# Altium schematic sheet Rx_logic.SchDoc: Balise IR-Rx - Logic
size A3; Author: B Labbe; CompanyName: Oufffteam; DrawnBy: B Labbe; Engineer: B Labbe; Organization: Oufffteam; Address1: L3, 12a Rodborough Rd; Address2: Frenchs Forest; Address3: NSW; Address4: Australia 2086; Revision: B; SheetNumber: 3; SheetTotal: 5; DocumentName: Balise IR-Rx - Logic
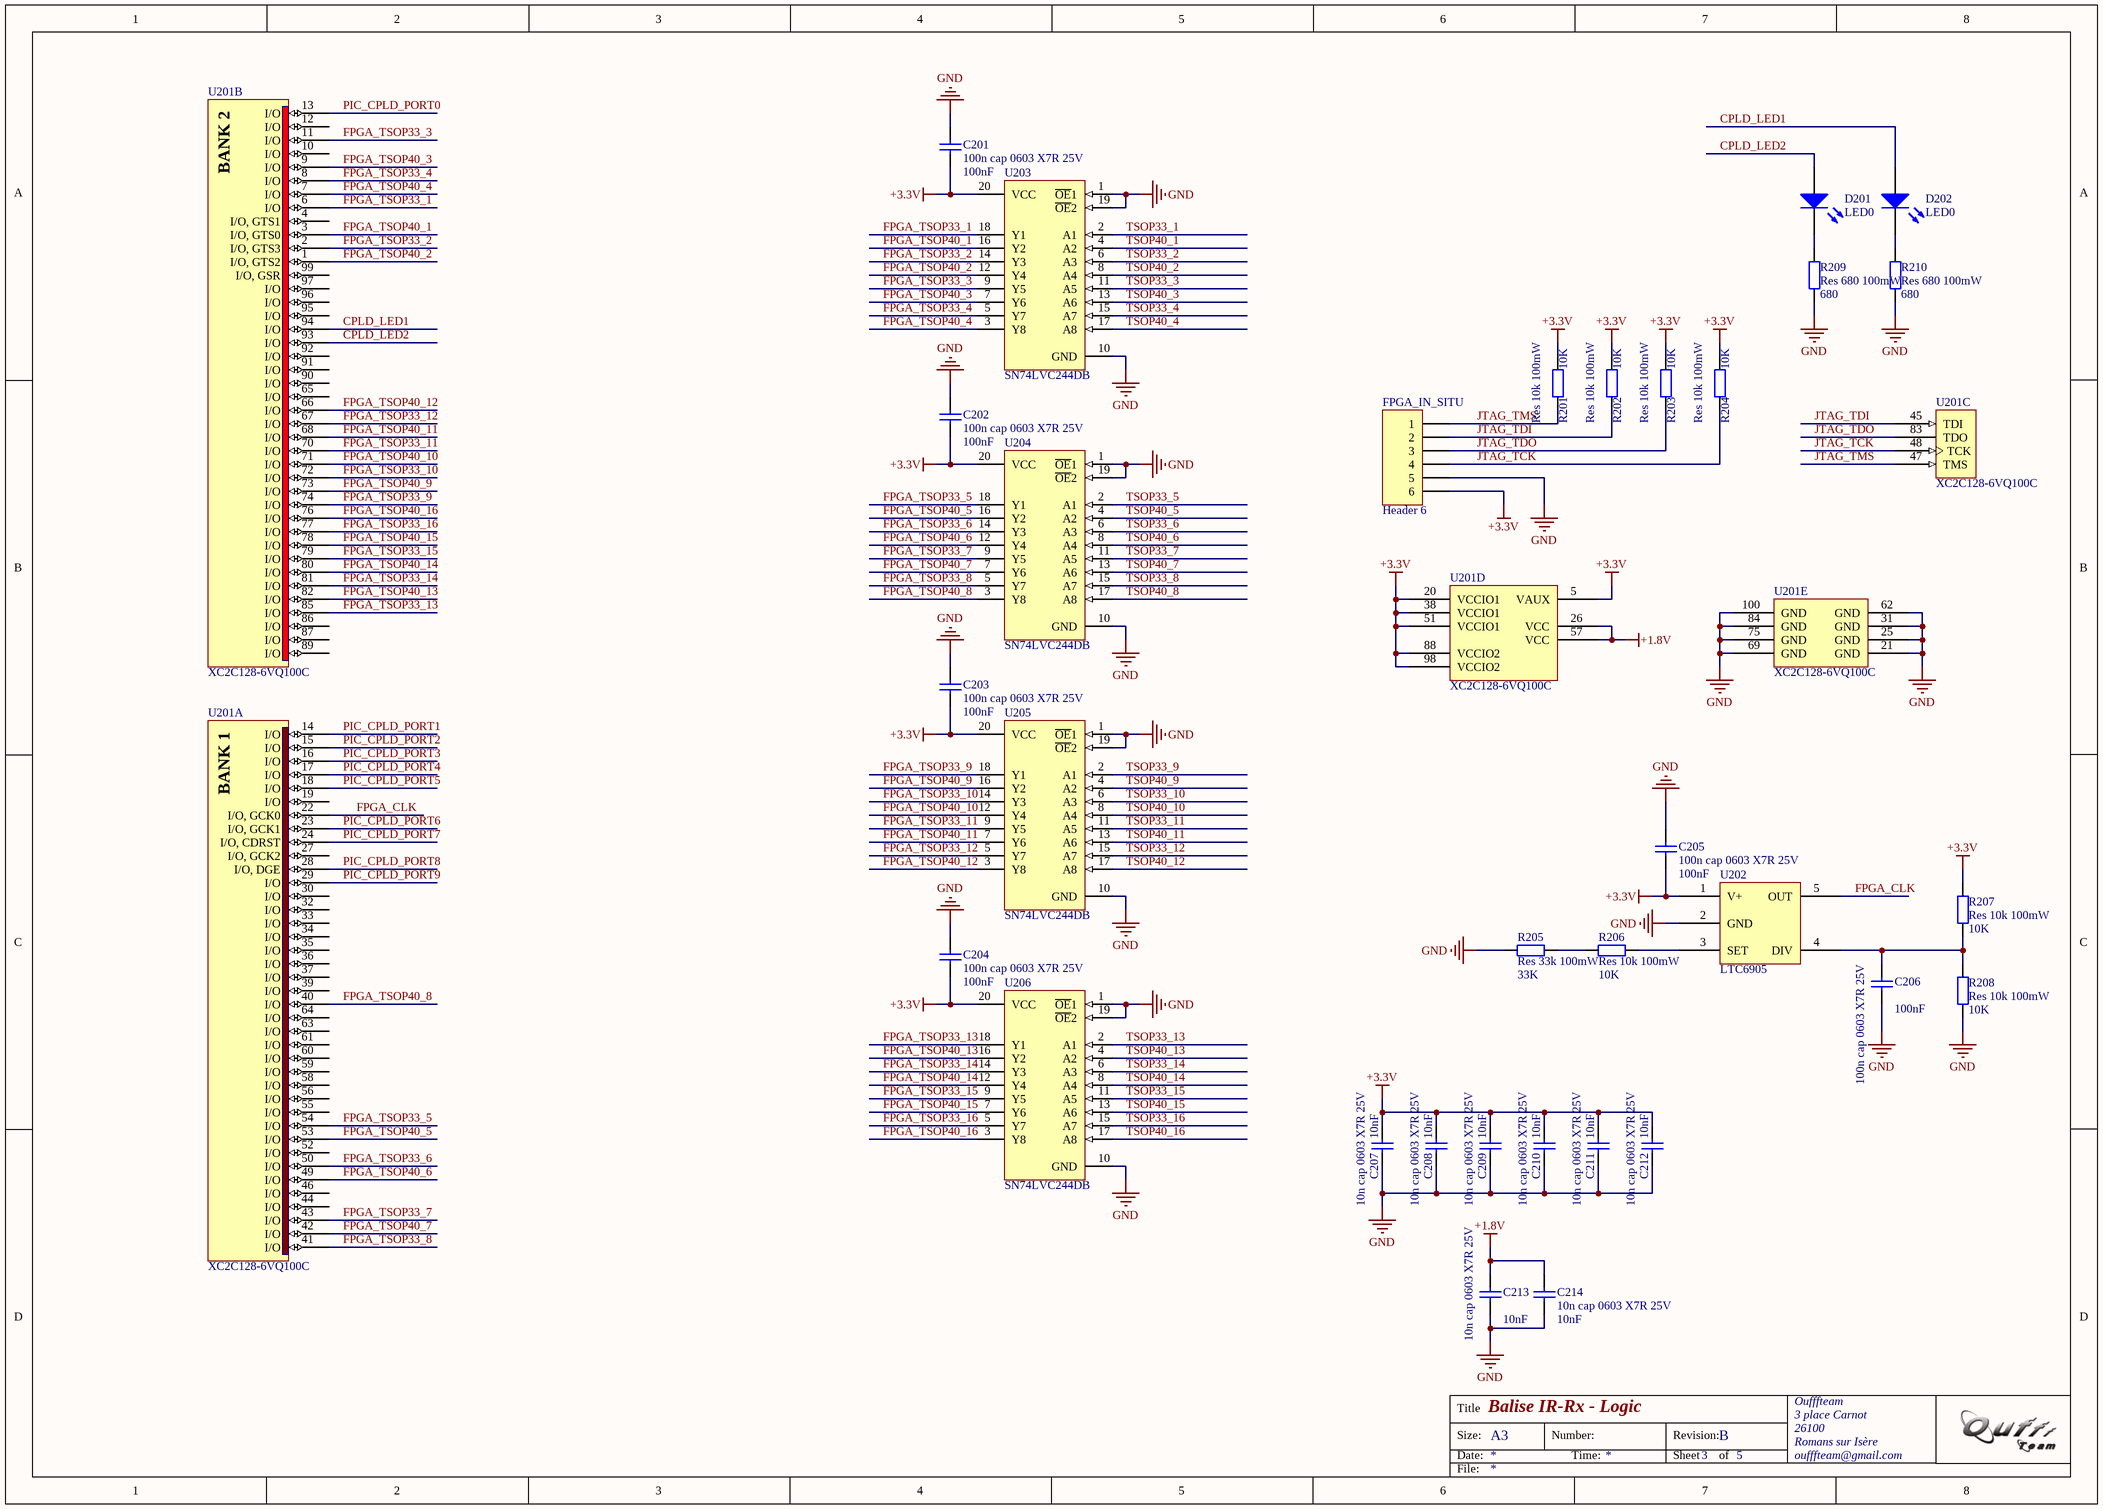
[diagram p0: Rx_logic.SchDoc]

## Parts
C201  100n cap 0603 X7R 25V  value 100nF  [0603]
C202  100n cap 0603 X7R 25V  value 100nF  [0603]
C203  100n cap 0603 X7R 25V  value 100nF  [0603]
C204  100n cap 0603 X7R 25V  value 100nF  [0603]
C205  100n cap 0603 X7R 25V  value 100nF  [0603]
C206  100n cap 0603 X7R 25V  value 100nF  [0603]
C207  10n cap 0603 X7R 25V  value 10nF  [0603]
C208  10n cap 0603 X7R 25V  value 10nF  [0603]
C209  10n cap 0603 X7R 25V  value 10nF  [0603]
C210  10n cap 0603 X7R 25V  value 10nF  [0603]
C211  10n cap 0603 X7R 25V  value 10nF  [0603]
C212  10n cap 0603 X7R 25V  value 10nF  [0603]
C213  10n cap 0603 X7R 25V  value 10nF  [0603]
C214  10n cap 0603 X7R 25V  value 10nF  [0603]
D201  LED0  [0603]
D202  LED0  [0603]
FPGA_IN_SITU  Header 6  [HDR1X6]
R201  Res 10k 100mW  value 10K  [0603]
R202  Res 10k 100mW  value 10K  [0603]
R203  Res 10k 100mW  value 10K  [0603]
R204  Res 10k 100mW  value 10K  [0603]
R205  Res 33k 100mW  value 33K  [0603]
R206  Res 10k 100mW  value 10K  [0603]
R207  Res 10k 100mW  value 10K  [0603]
R208  Res 10k 100mW  value 10K  [0603]
R209  Res 680 100mW  value 680  [0603]
R210  Res 680 100mW  value 680  [0603]
U201  XC2C128-6VQ100C  [VQ100_N]  (parts A,B,C,D,E of 5)
U202  LTC6905  [SOT23-5]
U203  SN74LVC244DB  [DB020_N]
U204  SN74LVC244DB  [DB020_N]
U205  SN74LVC244DB  [DB020_N]
U206  SN74LVC244DB  [DB020_N]

## Nets
+1.8V: C213.2 C214.2 U201.26(VCC) U201.57(VCC)
+3.3V: C201.1 C202.1 C203.1 C204.1 C205.1 C207.2 C208.2 C209.2 C210.2 C211.2 C212.2 FPGA_IN_SITU.6 R201.2 R202.2 R203.2 R204.2 R207.2 U201.5(VAUX) U201.20(VCCIO1) U201.38(VCCIO1) U201.51(VCCIO1) U201.88(VCCIO2) U201.98(VCCIO2) U202.1(V+) U203.20(VCC) U204.20(VCC) U205.20(VCC) U206.20(VCC)
GND: C201.2 C202.2 C203.2 C204.2 C205.2 C206.1 C207.1 C208.1 C209.1 C210.1 C211.1 C212.1 C213.1 C214.1 FPGA_IN_SITU.5 R205.1 R208.1 R209.2 R210.2 U201.21(GND) U201.25(GND) U201.31(GND) U201.62(GND) U201.69(GND) U201.75(GND) U201.84(GND) U201.100(GND) U202.2(GND) U203.1(~{OE}1) U203.10(GND) U203.19(~{OE}2) U204.1(~{OE}1) U204.10(GND) U204.19(~{OE}2) U205.1(~{OE}1) U205.10(GND) U205.19(~{OE}2) U206.1(~{OE}1) U206.10(GND) U206.19(~{OE}2)
CPLD_LED1: D202.1(A) U201.94(I/O)
CPLD_LED2: D201.1(A) U201.93(I/O)
FPGA_CLK: U201.22(I/O,_GCK0) U202.5(OUT)
FPGA_TSOP33_1: U201.6(I/O) U203.18(Y1)
FPGA_TSOP33_2: U201.2(I/O,_GTS3) U203.14(Y3)
FPGA_TSOP33_3: U201.11(I/O) U203.9(Y5)
FPGA_TSOP33_4: U201.8(I/O) U203.5(Y7)
FPGA_TSOP33_5: U201.54(I/O) U204.18(Y1)
FPGA_TSOP33_6: U201.50(I/O) U204.14(Y3)
FPGA_TSOP33_7: U201.43(I/O) U204.9(Y5)
FPGA_TSOP33_8: U201.41(I/O) U204.5(Y7)
FPGA_TSOP33_9: U201.74(I/O) U205.18(Y1)
FPGA_TSOP33_10: U201.72(I/O) U205.14(Y3)
FPGA_TSOP33_11: U201.70(I/O) U205.9(Y5)
FPGA_TSOP33_12: U201.67(I/O) U205.5(Y7)
FPGA_TSOP33_13: U201.85(I/O) U206.18(Y1)
FPGA_TSOP33_14: U201.81(I/O) U206.14(Y3)
FPGA_TSOP33_15: U201.79(I/O) U206.9(Y5)
FPGA_TSOP33_16: U201.77(I/O) U206.5(Y7)
FPGA_TSOP40_1: U201.3(I/O,_GTS0) U203.16(Y2)
FPGA_TSOP40_2: U201.1(I/O,_GTS2) U203.12(Y4)
FPGA_TSOP40_3: U201.9(I/O) U203.7(Y6)
FPGA_TSOP40_4: U201.7(I/O) U203.3(Y8)
FPGA_TSOP40_5: U201.53(I/O) U204.16(Y2)
FPGA_TSOP40_6: U201.49(I/O) U204.12(Y4)
FPGA_TSOP40_7: U201.42(I/O) U204.7(Y6)
FPGA_TSOP40_8: U201.40(I/O) U204.3(Y8)
FPGA_TSOP40_9: U201.73(I/O) U205.16(Y2)
FPGA_TSOP40_10: U201.71(I/O) U205.12(Y4)
FPGA_TSOP40_11: U201.68(I/O) U205.7(Y6)
FPGA_TSOP40_12: U201.66(I/O) U205.3(Y8)
FPGA_TSOP40_13: U201.82(I/O) U206.16(Y2)
FPGA_TSOP40_14: U201.80(I/O) U206.12(Y4)
FPGA_TSOP40_15: U201.78(I/O) U206.7(Y6)
FPGA_TSOP40_16: U201.76(I/O) U206.3(Y8)
JTAG_TCK: FPGA_IN_SITU.4 R204.1 U201.48(TCK)
JTAG_TDI: FPGA_IN_SITU.2 R202.1 U201.45(TDI)
JTAG_TDO: FPGA_IN_SITU.3 R203.1 U201.83(TDO)
JTAG_TMS: FPGA_IN_SITU.1 R201.1 U201.47(TMS)
PIC_CPLD_PORT0: U201.13(I/O)
PIC_CPLD_PORT1: U201.14(I/O)
PIC_CPLD_PORT2: U201.15(I/O)
PIC_CPLD_PORT3: U201.16(I/O)
PIC_CPLD_PORT4: U201.17(I/O)
PIC_CPLD_PORT5: U201.18(I/O)
PIC_CPLD_PORT6: U201.23(I/O,_GCK1)
PIC_CPLD_PORT7: U201.24(I/O,_CDRST)
PIC_CPLD_PORT8: U201.28(I/O,_DGE)
PIC_CPLD_PORT9: U201.29(I/O)
TSOP33_1: U203.2(A1)
TSOP33_2: U203.6(A3)
TSOP33_3: U203.11(A5)
TSOP33_4: U203.15(A7)
TSOP33_5: U204.2(A1)
TSOP33_6: U204.6(A3)
TSOP33_7: U204.11(A5)
TSOP33_8: U204.15(A7)
TSOP33_9: U205.2(A1)
TSOP33_10: U205.6(A3)
TSOP33_11: U205.11(A5)
TSOP33_12: U205.15(A7)
TSOP33_13: U206.2(A1)
TSOP33_14: U206.6(A3)
TSOP33_15: U206.11(A5)
TSOP33_16: U206.15(A7)
TSOP40_1: U203.4(A2)
TSOP40_2: U203.8(A4)
TSOP40_3: U203.13(A6)
TSOP40_4: U203.17(A8)
TSOP40_5: U204.4(A2)
TSOP40_6: U204.8(A4)
TSOP40_7: U204.13(A6)
TSOP40_8: U204.17(A8)
TSOP40_9: U205.4(A2)
TSOP40_10: U205.8(A4)
TSOP40_11: U205.13(A6)
TSOP40_12: U205.17(A8)
TSOP40_13: U206.4(A2)
TSOP40_14: U206.8(A4)
TSOP40_15: U206.13(A6)
TSOP40_16: U206.17(A8)
NetC206_2: C206.2 R207.1 R208.2 U202.4(DIV)
NetD201_2: D201.2(K) R209.1
NetD202_2: D202.2(K) R210.1
NetR205_2: R205.2 R206.1
NetR206_2: R206.2 U202.3(SET)

Not connected (* = marked no-connect by the designer): U201 4(I/O,_GTS1) 10(I/O) 12(I/O) 19(I/O) 27(I/O,_GCK2) 30(I/O) 32(I/O) 33(I/O) 34(I/O) 35(I/O) 36(I/O) 37(I/O) 39(I/O) 44(I/O) 46(I/O) 52(I/O) 55(I/O) 56(I/O) 58(I/O) 59(I/O) 60(I/O) 61(I/O) 63(I/O) 64(I/O) 65(I/O) 86(I/O) 87(I/O) 89(I/O) 90(I/O) 91(I/O) 92(I/O) 95(I/O) 96(I/O) 97(I/O) 99(I/O,_GSR)

## Notes on the sheet
- Title
- Size:
- Date:
- A3
- Number:
- Time:
- Revision:
- Sheet
- of
- Oufffteam
- 3 place Carnot
- 26100
- Romans sur Isère
- oufffteam@gmail.com
- File:
- (in symbol XC2C128-6VQ100C, part A) BANK 1
- (in symbol XC2C128-6VQ100C, part B) BANK 2

## Library data of the parts
C201-C214 = Cap: Capacitor; Published: 8-Jun-2000; LatestRevisionDate: 17-Jul-2002; LatestRevisionNote: Re-released for DXP Platform.; PackageReference: RAD-0.3; Publisher: Altium Limited
D201 D202 = LED0: 0603 Led; Published: 8-Jun-2000; LatestRevisionDate: 08-Jul-2005; LatestRevisionNote: Mech Layer 1 removed.; PackageReference: LED-0; Publisher: Altium Limited
FPGA_IN_SITU = Header 6: Header, 6-Pin; LatestRevisionDate: 17-Jul-2002; LatestRevisionNote: Re-released for DXP Platform.; Publisher: Altium Limited
R201-R210 = Res2: Resistor; Published: 8-Jun-2000; LatestRevisionDate: 17-Jul-2002; LatestRevisionNote: Re-released for DXP Platform.; PackageReference: AXIAL-0.4; Publisher: Altium Limited
U201 = XC2C128-6VQ100C: CoolRunner-II, 1.8V, 128 Macrocell CPLD, 100-Pin VQFP, Commercial Grade; ComponentAvailability: Not referenced in latest datasheet.; Published: 23-Sep-2002; LatestRevisionDate: 13-Apr-2006; LatestRevisionNote: IPC-7351 Footprint Added.; DatasheetVersion: ver2.5, Oct-2004; PackageVersion: ver1.2.1, Feb-2007; PackageReference: VQ100; Publisher: Altium Limited; PackageDescription: 100-Pin Very Thin Quad Flat Pack (VQ100); Code_JEDEC: MS-026-AED; ComponentLink1Description: Manufacturer Link; ComponentLink1URL: http://www.xilinx.com/products/silicon_solutions/cplds/coolrunner_series/coolrunner_ii_cplds/overview.htm; ComponentLink2Description: Datasheet; ComponentLink2URL: http://direct.xilinx.com/bvdocs/publications/ds093.pdf
U202 = LTC6905: 17MHz to 170MHz Resistor Set SOT-23 Oscillator
U203-U206 = SN74LVC244DB: Octal Buffer/Driver with 3-State Outputs; ComponentAvailability: Obsolete; Published: 8-Jun-2000; LatestRevisionDate: 16-Oct-2006; LatestRevisionNote: IPC-7351 Footprint Added.; DatasheetVersion: Mar-1994; PackageVersion: May-1999; PackageReference: DB020; Publisher: Altium Limited; PackageDescription: 20-Pin Plastic Small Outline Package 0.65 mm Pitch; Code_JEDEC: MO-150-AE; Code_IPC: SOP65P780-20; ComponentLink1Description: Manufacturer Link; ComponentLink1URL: http://www.ti.com/; ComponentLink2Description: Discontinuation Notice; ComponentLink2URL: http://focus.ti.com/docs/prod/folders/print/sn74lvc244.html